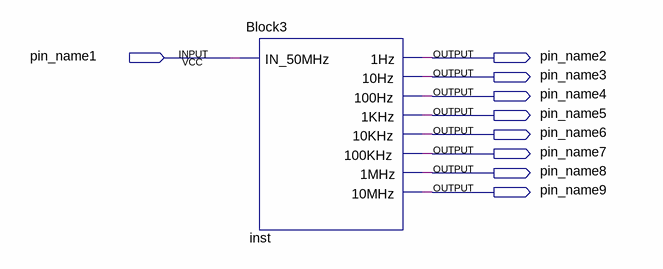
[diagram p0: schematic sheet]
// Quartus schematic Block4.bdf as structural Verilog: 1 symbols, 9 pins
module Block4 (
  input  pin_name1,
  output pin_name2,
  output pin_name3,
  output pin_name4,
  output pin_name5,
  output pin_name6,
  output pin_name7,
  output pin_name8,
  output pin_name9
);

  Block3 inst (
    .IN_50MHz(pin_name1), .\10MHz (pin_name9), .\1MHz (pin_name8), .\100KHz (pin_name7), .\10KHz (pin_name6),
    .\1Hz (pin_name2), .\1KHz (pin_name5), .\100Hz (pin_name4), .\10Hz (pin_name3));
endmodule
